# Altium schematic sheet Bank34.SchDoc
size A3; SheetNumber: 7; SheetTotal: 9
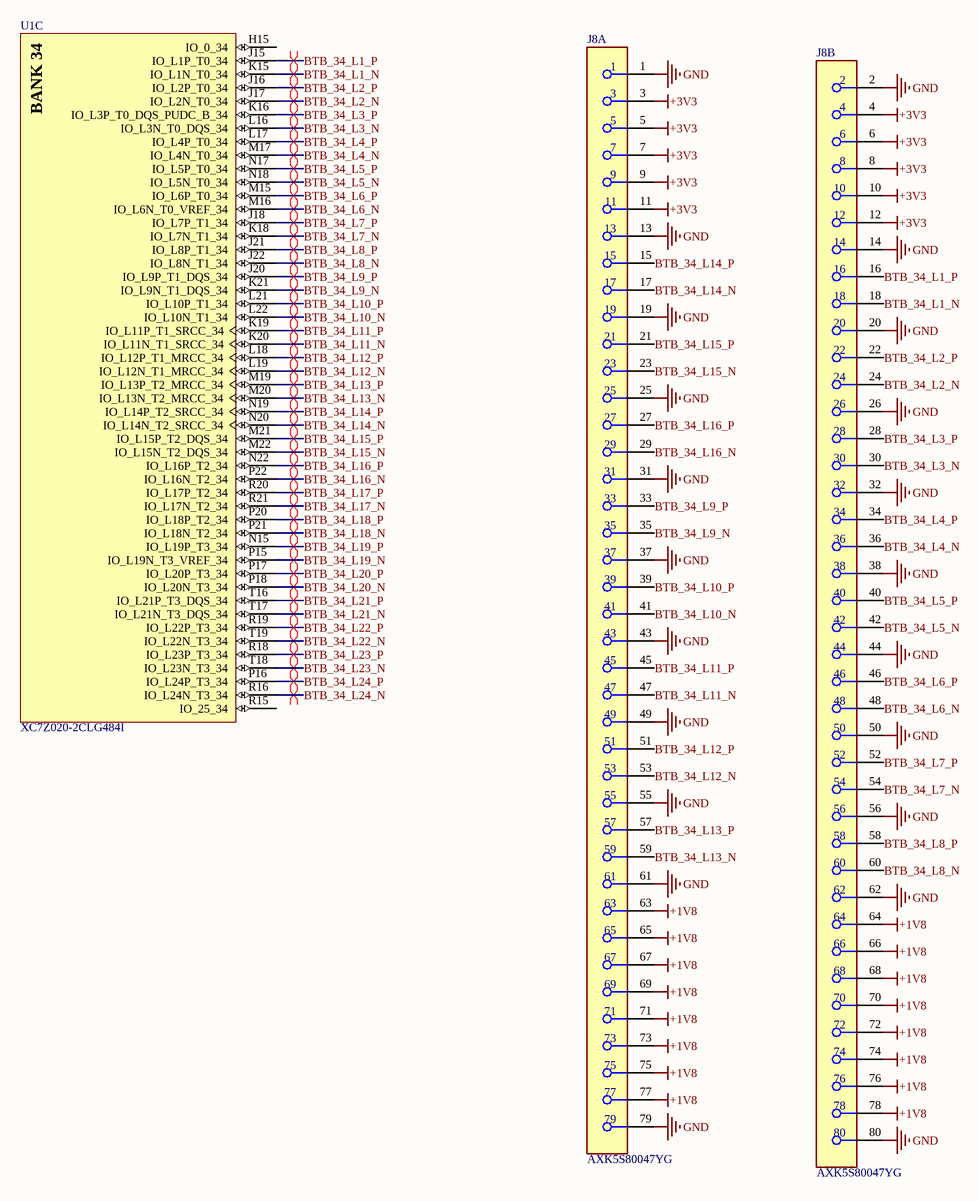
[diagram p0: Bank34.SchDoc]

## Parts
J8  AXK5S80047YG  [FP-AXK5S80047YG-MFG]  (parts A,B of 2)
U1  XC7Z020-2CLG484I  [CLG484]  (part C of 10)

## Nets
+1V8: J8.63 J8.64 J8.65 J8.66 J8.67 J8.68 J8.69 J8.70 J8.71 J8.72 J8.73 J8.74 J8.75 J8.76 J8.77 J8.78
+3V3: J8.3 J8.4 J8.5 J8.6 J8.7 J8.8 J8.9 J8.10 J8.11 J8.12
GND: J8.1 J8.2 J8.13 J8.14 J8.19 J8.20 J8.25 J8.26 J8.31 J8.32 J8.37 J8.38 J8.43 J8.44 J8.49 J8.50 J8.55 J8.56 J8.61 J8.62 J8.79 J8.80
BTB_34_L1_N: J8.18 U1.K15(IO_L1N_T0_34)
BTB_34_L1_P: J8.16 U1.J15(IO_L1P_T0_34)
BTB_34_L2_N: J8.24 U1.J17(IO_L2N_T0_34)
BTB_34_L2_P: J8.22 U1.J16(IO_L2P_T0_34)
BTB_34_L3_N: J8.30 U1.L16(IO_L3N_T0_DQS_34)
BTB_34_L3_P: J8.28 U1.K16(IO_L3P_T0_DQS_PUDC_B_34)
BTB_34_L4_N: J8.36 U1.M17(IO_L4N_T0_34)
BTB_34_L4_P: J8.34 U1.L17(IO_L4P_T0_34)
BTB_34_L5_N: J8.42 U1.N18(IO_L5N_T0_34)
BTB_34_L5_P: J8.40 U1.N17(IO_L5P_T0_34)
BTB_34_L6_N: J8.48 U1.M16(IO_L6N_T0_VREF_34)
BTB_34_L6_P: J8.46 U1.M15(IO_L6P_T0_34)
BTB_34_L7_N: J8.54 U1.K18(IO_L7N_T1_34)
BTB_34_L7_P: J8.52 U1.J18(IO_L7P_T1_34)
BTB_34_L8_N: J8.60 U1.J22(IO_L8N_T1_34)
BTB_34_L8_P: J8.58 U1.J21(IO_L8P_T1_34)
BTB_34_L9_N: J8.35 U1.K21(IO_L9N_T1_DQS_34)
BTB_34_L9_P: J8.33 U1.J20(IO_L9P_T1_DQS_34)
BTB_34_L10_N: J8.41 U1.L22(IO_L10N_T1_34)
BTB_34_L10_P: J8.39 U1.L21(IO_L10P_T1_34)
BTB_34_L11_N: J8.47 U1.K20(IO_L11N_T1_SRCC_34)
BTB_34_L11_P: J8.45 U1.K19(IO_L11P_T1_SRCC_34)
BTB_34_L12_N: J8.53 U1.L19(IO_L12N_T1_MRCC_34)
BTB_34_L12_P: J8.51 U1.L18(IO_L12P_T1_MRCC_34)
BTB_34_L13_N: J8.59 U1.M20(IO_L13N_T2_MRCC_34)
BTB_34_L13_P: J8.57 U1.M19(IO_L13P_T2_MRCC_34)
BTB_34_L14_N: J8.17 U1.N20(IO_L14N_T2_SRCC_34)
BTB_34_L14_P: J8.15 U1.N19(IO_L14P_T2_SRCC_34)
BTB_34_L15_N: J8.23 U1.M22(IO_L15N_T2_DQS_34)
BTB_34_L15_P: J8.21 U1.M21(IO_L15P_T2_DQS_34)
BTB_34_L16_N: J8.29 U1.P22(IO_L16N_T2_34)
BTB_34_L16_P: J8.27 U1.N22(IO_L16P_T2_34)
BTB_34_L17_N: U1.R21(IO_L17N_T2_34)
BTB_34_L17_P: U1.R20(IO_L17P_T2_34)
BTB_34_L18_N: U1.P21(IO_L18N_T2_34)
BTB_34_L18_P: U1.P20(IO_L18P_T2_34)
BTB_34_L19_N: U1.P15(IO_L19N_T3_VREF_34)
BTB_34_L19_P: U1.N15(IO_L19P_T3_34)
BTB_34_L20_N: U1.P18(IO_L20N_T3_34)
BTB_34_L20_P: U1.P17(IO_L20P_T3_34)
BTB_34_L21_N: U1.T17(IO_L21N_T3_DQS_34)
BTB_34_L21_P: U1.T16(IO_L21P_T3_DQS_34)
BTB_34_L22_N: U1.T19(IO_L22N_T3_34)
BTB_34_L22_P: U1.R19(IO_L22P_T3_34)
BTB_34_L23_N: U1.T18(IO_L23N_T3_34)
BTB_34_L23_P: U1.R18(IO_L23P_T3_34)
BTB_34_L24_N: U1.R16(IO_L24N_T3_34)
BTB_34_L24_P: U1.P16(IO_L24P_T3_34)

Not connected (* = marked no-connect by the designer): U1 H15(IO_0_34) R15(IO_25_34)

## Layout directives
differential pair: BTB_34_L1_N, BTB_34_L1_P, BTB_34_L2_N, BTB_34_L2_P, BTB_34_L3_N, BTB_34_L3_P, BTB_34_L4_N, BTB_34_L4_P, BTB_34_L5_N, BTB_34_L5_P, BTB_34_L6_N, BTB_34_L6_P, BTB_34_L7_N, BTB_34_L7_P, BTB_34_L8_N, BTB_34_L8_P, BTB_34_L9_N, BTB_34_L9_P, BTB_34_L10_N, BTB_34_L10_P, BTB_34_L11_N, BTB_34_L11_P, BTB_34_L12_N, BTB_34_L12_P, BTB_34_L13_N, BTB_34_L13_P, BTB_34_L14_N, BTB_34_L14_P, BTB_34_L15_N, BTB_34_L15_P, BTB_34_L16_N, BTB_34_L16_P, BTB_34_L17_N, BTB_34_L17_P, BTB_34_L18_N, BTB_34_L18_P, BTB_34_L19_N, BTB_34_L19_P, BTB_34_L20_N, BTB_34_L20_P, BTB_34_L21_N, BTB_34_L21_P, BTB_34_L22_N, BTB_34_L22_P, BTB_34_L23_N, BTB_34_L23_P, BTB_34_L24_N, BTB_34_L24_P

## Notes on the sheet
- (in symbol CMP-0363-00013-3, part C) BANK 34

## Library data of the parts
J8 = CMP-05580-000001-1: CONN SOCKET BRD/BRD .5MM 80POS; Manufacturer: Panasonic; Is Female: yes; Current Rating: 0.5A; Voltage Rating: 60V; Conn Orientation: Vertical; Number Of Contacts: 80; Conn Gender: Female; Pitch: 0.5mm; Octopart: https://octopart.com/axk5s80047yg-panasonic-7879921; Device Class L1: Connectors; ComponentLink2Description: Datasheet; Ambient Temperature Range Low: -55°C; Package: AXK5S80047YG; Height: 3.25mm; Number Of Rows: 2; Device Class L3: unset; Lead Free: Yes; Category: Conn; Contact Material: Gold,Nickel; Device Class L2: Headers and Wire Housings; Mouser Description: Board to Board & Mezzanine Connectors CONN SOCKET BRD/BRD 80 POS 0.5mm; Ambient Temperature Range High: +85°C; ComponentLink2URL: https://www3.panasonic.biz/ac/e_download/control/connector/base-base/catalog/con_eng_p5k.pdf; Automotive: No; RoHS: TRUE; Digikey Description: CONN SOCKET BRD/BRD .5MM 80POS; Manufacturer Part Number: AXK5S80047YG
U1 = CMP-0363-00013-3: 733 MHz Zynq™-7000 AP SoC, 130 PS I/O, 200 FPGA I/O, 484-Ball BGA, Speed Grade 2, Industrial Grade, Pb-Free; Speed Grade: -2; Flip Flops: 106400; LUTs: 53200; Extensible Block RAM (# 36Kb Blocks): 560 KB (140); ComponentLink3URL: http://www.xilinx.com/support/documentation/data_sheets/ds187-XC7Z010-XC7Z020-Data-Sheet.pdf; PackageReference: CLG484; Code_JEDEC: MO-275-PPAA-2; ComponentLink2URL: http://www.xilinx.com/support/documentation/user_guides/ug865-Zynq-7000-Pkg-Pinout.pdf; ComponentLink2Description: Package Specification; ComponentLink6URL: http://www.xilinx.com/support/documentation/user_guides/ug483_7Series_PCB.pdf; PackageVersion: Rev 1.1, 09/2012; DatasheetVersion: v1.2; PartNumber: XC7Z020-2CLG484I; ComponentLink3Description: DC and AC Switching Characteristics; PackageDescription: Wire-Bond Chip-Scale BGA, Body 19 x 19 mm, 0.8 mm Pitch; RoHS: Pb-Free; ComponentLink5URL: http://www.xilinx.com/support/documentation/user_guides/ug865-Zynq-7000-Pkg-Pinout.pdf; ComponentLink1URL: http://www.xilinx.com/support/documentation/data_sheets/ds190-Zynq-7000-Overview.pdf; ComponentLink4Description: Package File; Generic Part Number: XC7Z020; Mounting Technology: Surface Mount; ComponentLink1Description: Datasheet; ComponentLink4URL: http://www.xilinx.com/support/packagefiles/z7packages/xc7z020clg484pkg.txt; ComponentLink6Description: PCB and Layout Guide; ComponentLink5Description: Packaging and Pinout